# EAGLE design Old_Glove (EAGLE 5.04)
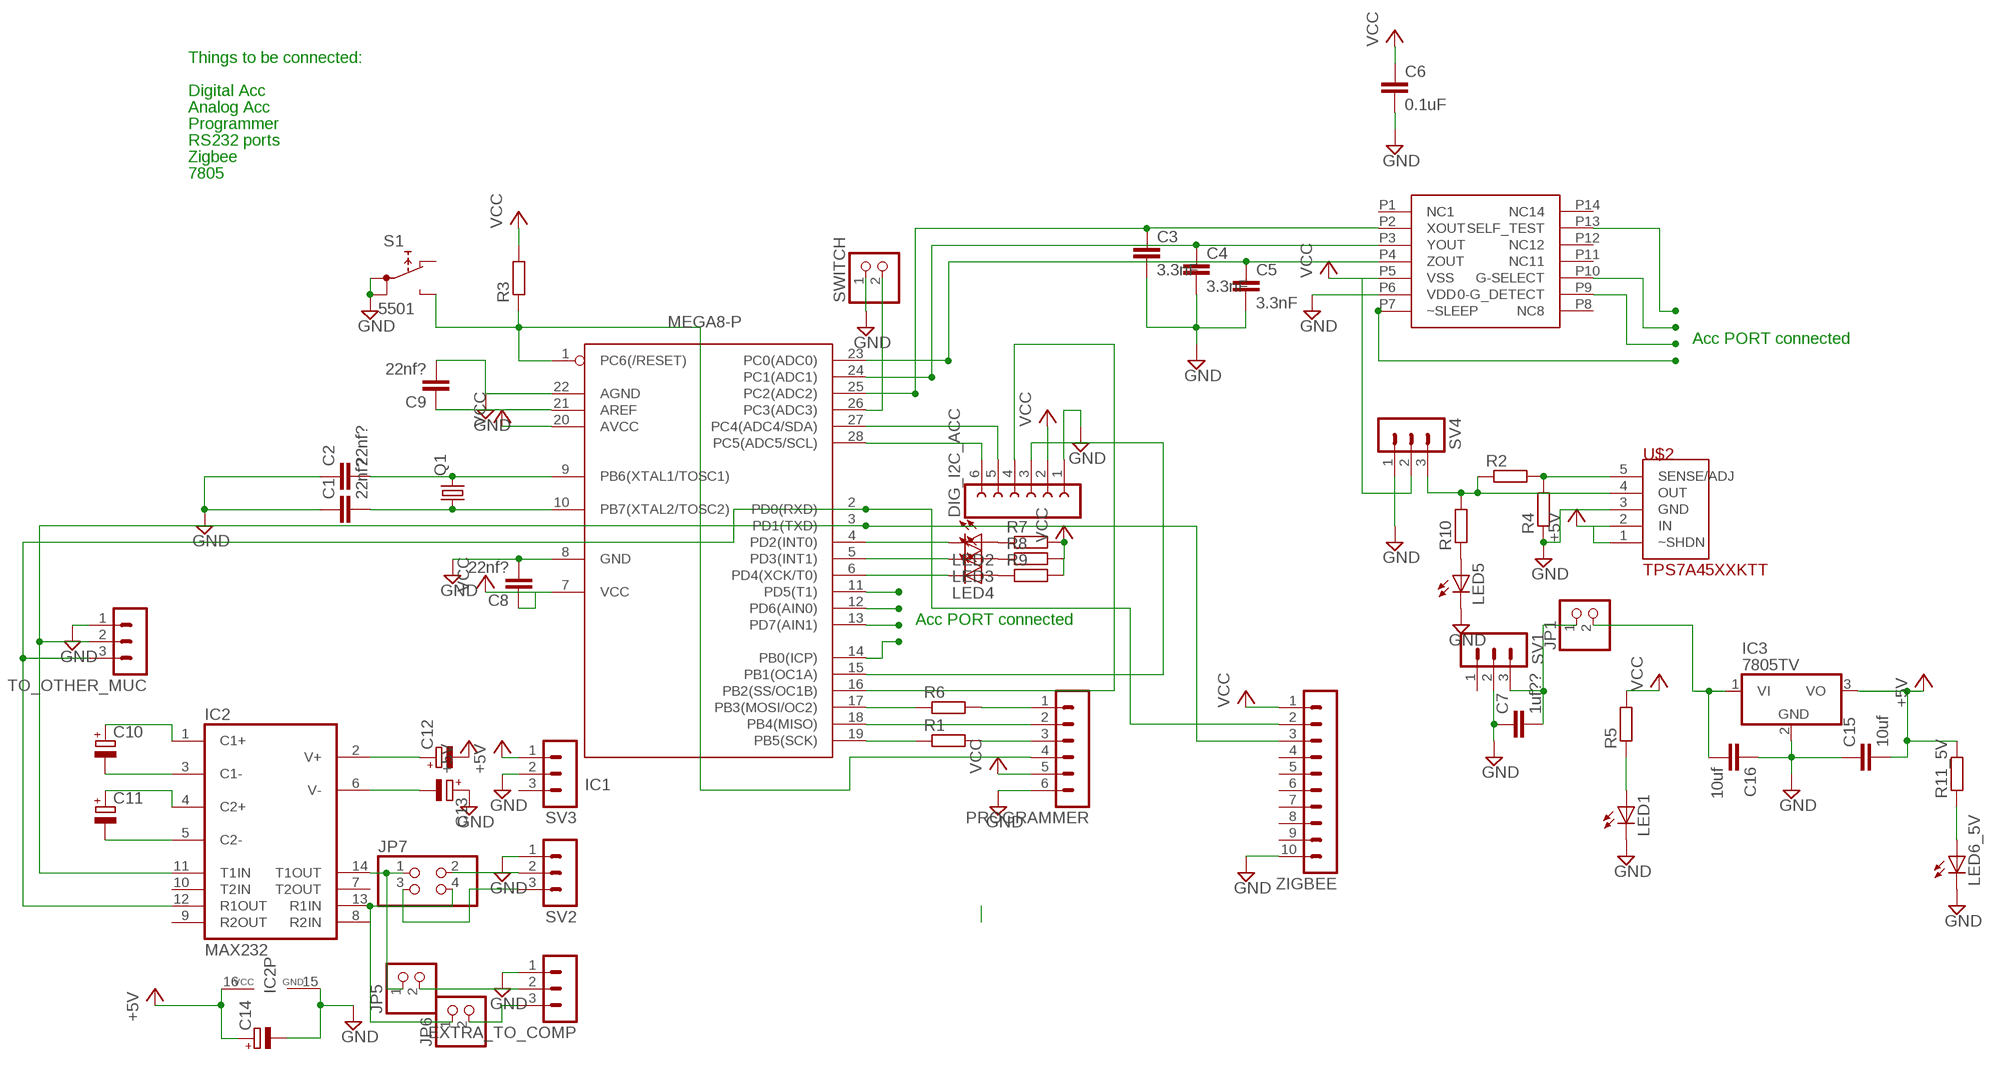
[diagram p0: schematic, sheet 1]

## Parts
C1  22nf?  C-EU025-025X050  [C025-025X050]
C2  22nf?  C-EU025-025X050  [C025-025X050]
C3  3.3nF  C-EUC1206  [C1206]
C4  3.3nF  C-EUC1206  [C1206]
C5  3.3nF  C-EUC1206  [C1206]
C6  0.1uF  C-EUC1206  [C1206]
C7  1uf??  C-EU025-025X050  [C025-025X050]
C8  22nf?  C-EU025-025X050  [C025-025X050]
C9  22nf?  C-EU025-025X050  [C025-025X050]
C10  CPOL-EUE1.8-4  [E1,8-4]
C11  CPOL-EUE1.8-4  [E1,8-4]
C12  CPOL-EUE1.8-4  [E1,8-4]
C13  CPOL-EUE1.8-4  [E1,8-4]
C14  CPOL-EUE1.8-4  [E1,8-4]
C15  10uf  C-EU025-025X050  [C025-025X050]
C16  10uf  C-EU025-025X050  [C025-025X050]
DIG_I2C_ACC  FE06-1  [FE06]
EXTRA_TO_COMP  MA03-1  [MA03-1]
IC1  MEGA8-P  [DIL28-3]
IC2  MAX232  [DIL16]
IC3  7805TV  [TO220V]
JP1  PINHD-1X2  [1X02]
JP5  PINHD-1X2  [1X02]
JP6  PINHD-1X2  [1X02]
JP7  PINHD-2X2  [2X02]
LED1  LED3MM  [LED3MM]
LED2  LED3MM  [LED3MM]
LED3  LED3MM  [LED3MM]
LED4  LED3MM  [LED3MM]
LED5  LED3MM  [LED3MM]
LED6_5V  LED3MM  [LED3MM]
PROGRAMMER  MA06-1  [MA06-1]
Q1  CRYSTALHC49S  [HC49/S]
R1  R-EU_0207/7  [0207/7]
R2  R-EU_0207/7  [0207/7]
R3  R-EU_0207/7  [0207/7]
R4  R-EU_0207/7  [0207/7]
R5  R-EU_0207/7  [0207/7]
R6  R-EU_0207/7  [0207/7]
R7  R-EU_0207/7  [0207/7]
R8  R-EU_0207/7  [0207/7]
R9  R-EU_0207/7  [0207/7]
R10  R-EU_0207/7  [0207/7]
R11_5V  R-EU_0207/7  [0207/7]
S1  5501  [5501]
SV1  MA03-1  [MA03-1]
SV2  MA03-1  [MA03-1]
SV3  MA03-1  [MA03-1]
SV4  MA03-1  [MA03-1]
SWITCH  PINHD-1X2  [1X02]
TO_OTHER_MUC  MA03-1  [MA03-1]
U$1  MMA7361LCMMA7361EXT  [LGA-14EXT]
U$2  TPS7A45XXKTT  [TO263-5]
ZIGBEE  MA10-1  [MA10-1]

## Nets
+5V: C12.- C14.+ C15.2 IC2.16(VCC) IC3.3(VO) R11_5V.2 SV3.1 U$2.1(~SHDN) U$2.2(IN)
AC1: IC1.11(PD5(T1)) U$1.P7(~SLEEP)
AC2: IC1.12(PD6(AIN0)) U$1.P9(0-G_DETECT)
AC3: IC1.13(PD7(AIN1)) U$1.P10(G-SELECT)
AC4: IC1.14(PB0(ICP)) U$1.P13(SELF_TEST)
GND: C1.1 C2.1 C3.2 C4.2 C5.2 C6.2 C7.1 C8.2 C9.2 C13.+ C14.- C15.1 C16.1 DIG_I2C_ACC.1 EXTRA_TO_COMP.1 IC1.8(GND) IC1.22(AGND) IC2.15(GND) IC3.2(GND) LED1.K(C) LED5.K(C) LED6_5V.K(C) PROGRAMMER.6 R4.1 S1.1A S1.1B SV1.2 SV2.1 SV3.2 SV4.1 SWITCH.1 TO_OTHER_MUC.1 U$1.P6(VDD) U$2.3(GND) ZIGBEE.10
N$1: IC1.17(PB3(MOSI/OC2)) R6.1
N$2: PROGRAMMER.1 R6.2
N$3: IC1.18(PB4(MISO)) PROGRAMMER.2
N$4: IC1.19(PB5(SCK)) R1.1
N$5: PROGRAMMER.3 R1.2
N$6: IC1.1(PC6(/RESET)) PROGRAMMER.4 R3.1 S1.NO
N$7: C1.2 IC1.10(PB7(XTAL2/TOSC2)) Q1.1
N$8: C2.2 IC1.9(PB6(XTAL1/TOSC1)) Q1.2
N$9: DIG_I2C_ACC.6 IC1.28(PC5(ADC5/SCL))
N$10: DIG_I2C_ACC.5 IC1.27(PC4(ADC4/SDA))
N$11: DIG_I2C_ACC.3 IC1.15(PB1(OC1A))
N$12: DIG_I2C_ACC.4 IC1.16(PB2(SS/OC1B))
N$13: C5.1 IC1.23(PC0(ADC0)) U$1.P4(ZOUT)
N$14: C4.1 IC1.24(PC1(ADC1)) U$1.P3(YOUT)
N$15: C3.1 IC1.25(PC2(ADC2)) U$1.P2(XOUT)
N$16: LED6_5V.A R11_5V.1
N$17: IC1.3(PD1(TXD)) IC2.11(T1IN) TO_OTHER_MUC.2 ZIGBEE.3
N$18: IC1.2(PD0(RXD)) IC2.12(R1OUT) TO_OTHER_MUC.3 ZIGBEE.2
N$19: R2.2 R4.2 U$2.5(SENSE/ADJ)
N$20: R2.1 R10.2 SV4.3 U$2.4(OUT)
N$21: C9.1 IC1.21(AREF)
N$22: IC1.4(PD2(INT0)) LED2.K(C)
N$23: IC1.5(PD3(INT1)) LED3.K(C)
N$24: IC1.6(PD4(XCK/T0)) LED4.K(C)
N$25: LED1.A R5.1
N$26: LED2.A R7.1
N$27: LED3.A R8.1
N$28: LED4.A R9.1
N$29: LED5.A R10.1
N$30: IC1.26(PC3(ADC3)) SWITCH.2
N$33: C16.2 IC3.1(VI) JP1.2
N$34: JP7.2 SV2.2
N$35: C10.+ IC2.1(C1+)
N$36: C10.- IC2.3(C1-)
N$37: C11.+ IC2.4(C2+)
N$38: C11.- IC2.5(C2-)
N$39: C12.+ IC2.2(V+)
N$40: C13.- IC2.6(V-)
N$41: IC2.14(T1OUT) JP5.1 JP7.1
N$42: IC2.13(R1IN) JP6.1 JP7.4
N$43: C7.2 JP1.1 SV1.3
N$44: JP7.3 SV2.3
N$45: EXTRA_TO_COMP.2 JP5.2
N$47: EXTRA_TO_COMP.3 JP6.2
VCC: C6.1 C8.1 DIG_I2C_ACC.2 IC1.7(VCC) IC1.20(AVCC) PROGRAMMER.5 R3.2 R5.2 R7.2 R8.2 R9.2 SV4.2 U$1.P5(VSS) ZIGBEE.1
Unconnected: IC2.7(T2OUT) IC2.8(R2IN) IC2.9(R2OUT) IC2.10(T2IN) S1.NC SV1.1 SV3.3 U$1.P1(NC1) U$1.P8(NC8) U$1.P11(NC11) U$1.P12(NC12) U$1.P14(NC14) ZIGBEE.4 ZIGBEE.5 ZIGBEE.6 ZIGBEE.7 ZIGBEE.8 ZIGBEE.9

## Notes on the sheet
- Things to be connected:
- Digital Acc
- Analog Acc
- Programmer
- RS232 ports
- Zigbee
- 7805
- Acc PORT connected
- Acc PORT connected

## Library data of the parts
C1-C9 C15 C16 = rcl:C-EU: CAPACITOR, European symbol
C10-C14 = rcl:CPOL-EU: POLARIZED CAPACITOR, European symbol
DIG_I2C_ACC = con-lsta:FE06-1: FEMALE HEADER
EXTRA_TO_COMP SV1-SV4 TO_OTHER_MUC = con-lstb:MA03-1: PIN HEADER
IC1 = atmel:MEGA8-P: MICROCONTROLLER 8 Kbytes FLASH, 1 kbytes SRAM, 512 bytes EEPROM, USART, 4-channel 10 bit ADC, 2-channel 8 bit ADC Pin compatible with Atmega48, ATMega88, ATMega168 Source: avr.lbr
IC2 = maxim:MAX232: RS232 TRANSEIVER
IC3 = linear:78*: Positive VOLTAGE REGULATOR Source: http://cache.national.com/ds/LM/LM78L05.pdf http://www.fairchildsemi.com/ds/LM/LM7805.pdf
JP1 JP5 JP6 SWITCH = pinhead:PINHD-1X2: PIN HEADER
JP7 = pinhead:PINHD-2X2: PIN HEADER
LED1-LED5 LED6_5V = led:LED: LED OSRAM: - CHIPLED LG R971, LG N971, LY N971, LG Q971, LY Q971, LO R971, LY R971 LH N974, LH R974 LS Q976, LO Q976, LY Q976 LO Q996 - Hyper CHIPLED LW Q18S LB Q993, LB Q99A, LB R99A - SideLED LS A670, LO A670, LY A670, LG A670, LP A670 LB A673, LV A673, LT A673, LW A673 LH A674 LY A675 LS A676, LA A676, LO A676, LY A676, LW A676 LS A679, LY A679, LG A679 - Hyper Micro SIDELED® LS Y876, LA Y876, LO Y876, LY Y876 LT Y87S - SmartLED LW L88C, LW L88S LB L89C, LB L89S, LG L890 LS L89K, LO L89K, LY L89K LS L896, LA L896, LO L896, LY L896 - TOPLED LS T670, LO T670, LY T670, LG T670, LP T670 LSG T670, LSP T670, LSY T670, LOP T670, LYG T670 LG T671, LOG T671, LSG T671 LB T673, LV T673, LT T673, LW T673 LH T674 LS T676, LA T676, LO T676, LY T676, LB T676, LH T676, LSB T676, LW T676 LB T67C, LV T67C, LT T67C, LS T67K, LO T67K, LY T67K, LW E67C LS E67B, LA E67B, LO E67B, LY E67B, LB E67C, LV E67C, LT E67C LW T67C LS T679, LY T679, LG T679 LS T770, LO T770, LY T770, LG T770, LP T770 LB T773, LV T773, LT T773, LW T773 LH T774 LS E675, LA E675, LY E675, LS T675 LS T776, LA T776, LO T776, LY T776, LB T776 LHGB T686 LT T68C, LB T68C - Hyper Mini TOPLED® LB M676 - Mini TOPLED Santana® LG M470 LS M47K, LO M47K, LY M47K Source: http://www.osram.convergy.de - LUMILED® LXK2-PW12-R00, LXK2-PW12-S00, LXK2-PW14-U00, LXK2-PW14-V00 LXK2-PM12-R00, LXK2-PM12-S00, LXK2-PM14-U00 LXK2-PE12-Q00, LXK2-PE12-R00, LXK2-PE12-S00, LXK2-PE14-T00, LXK2-PE14-U00 LXK2-PB12-K00, LXK2-PB12-L00, LXK2-PB12-M00, LXK2-PB14-N00, LXK2-PB14-P00, LXK2-PB14-Q00 LXK2-PR12-L00, LXK2-PR12-M00, LXK2-PR14-Q00, LXK2-PR14-R00 LXK2-PD12-Q00, LXK2-PD12-R00, LXK2-PD12-S00 LXK2-PH12-R00, LXK2-PH12-S00 LXK2-PL12-P00, LXK2-PL12-Q00, LXK2-PL12-R00 Source: www.luxeon.com
PROGRAMMER = con-lstb:MA06-1: PIN HEADER
Q1 = crystal:CRYSTAL: CRYSTAL
R1-R10 R11_5V = resistor:R-EU_: RESISTOR, European symbol
S1 = switch:55?: PUSHBUTTON SERIES 5500 SWITCHES Source: www.e-switch.com .. 5500.pdf
U$1 = MMA:MMA7361LC
U$2 = m:TPS7A45XX
ZIGBEE = con-lstb:MA10-1: PIN HEADER

## Board
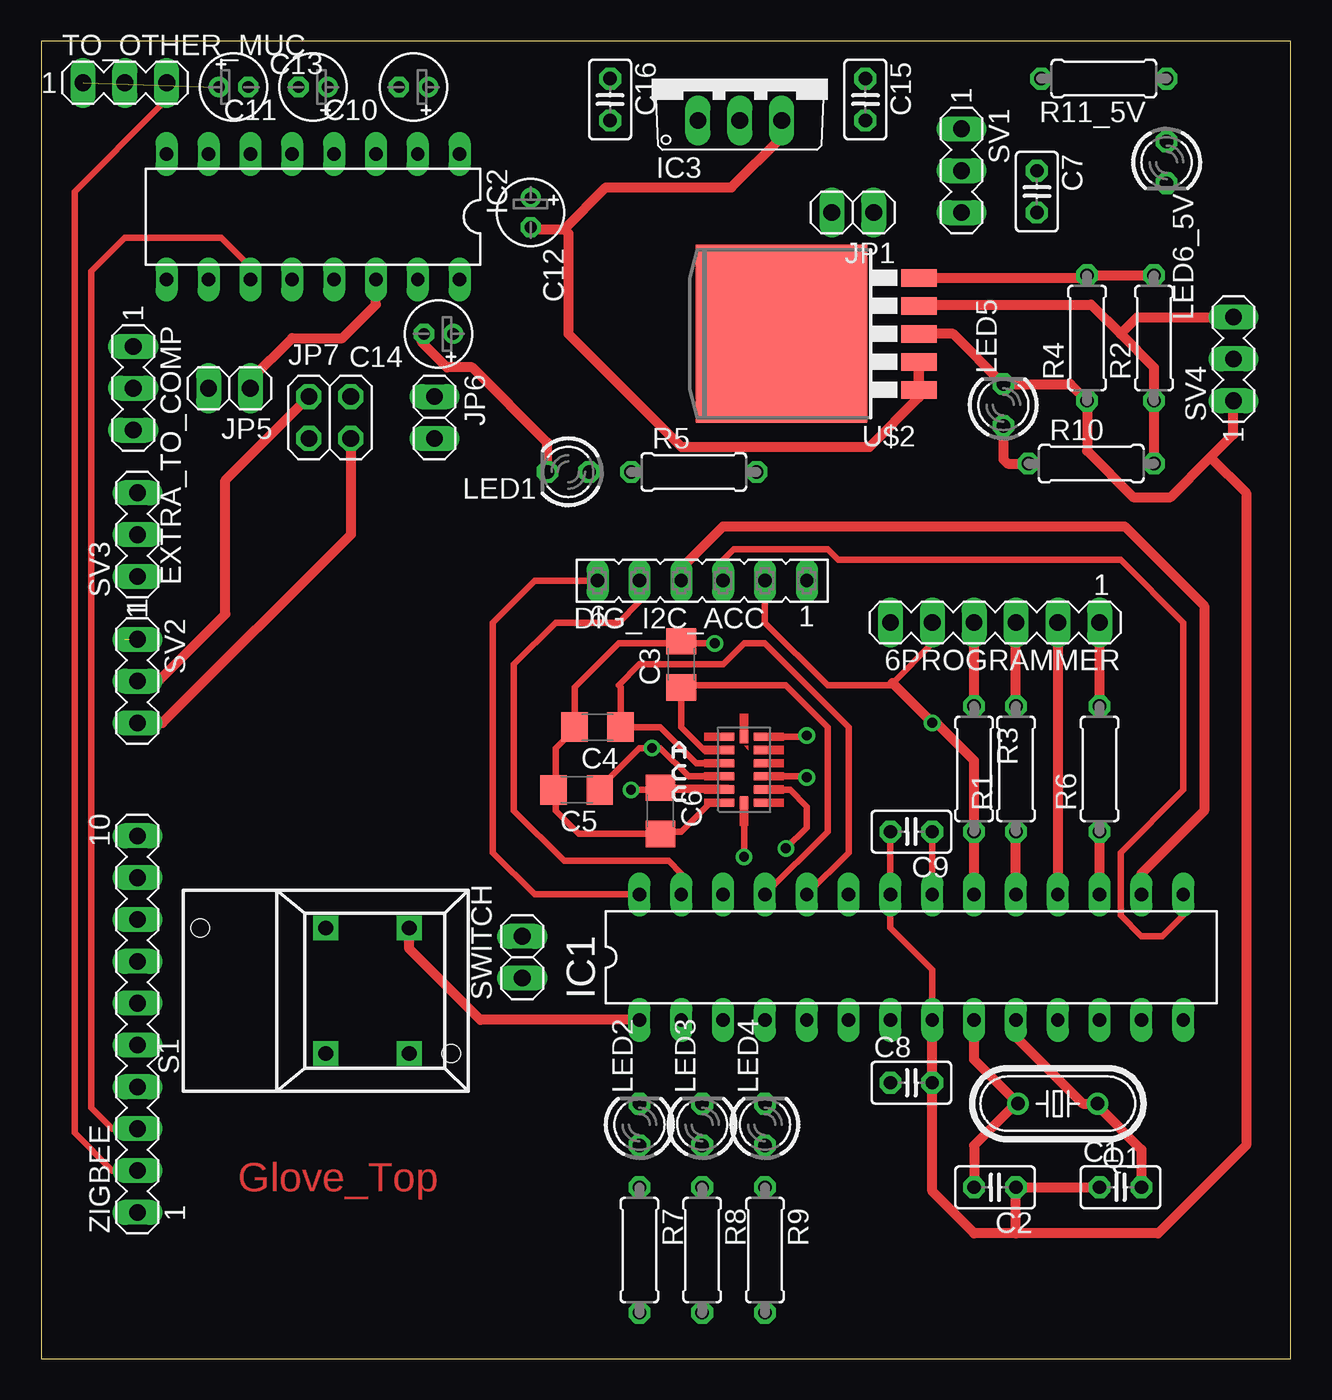
[diagram p1: board, top side]
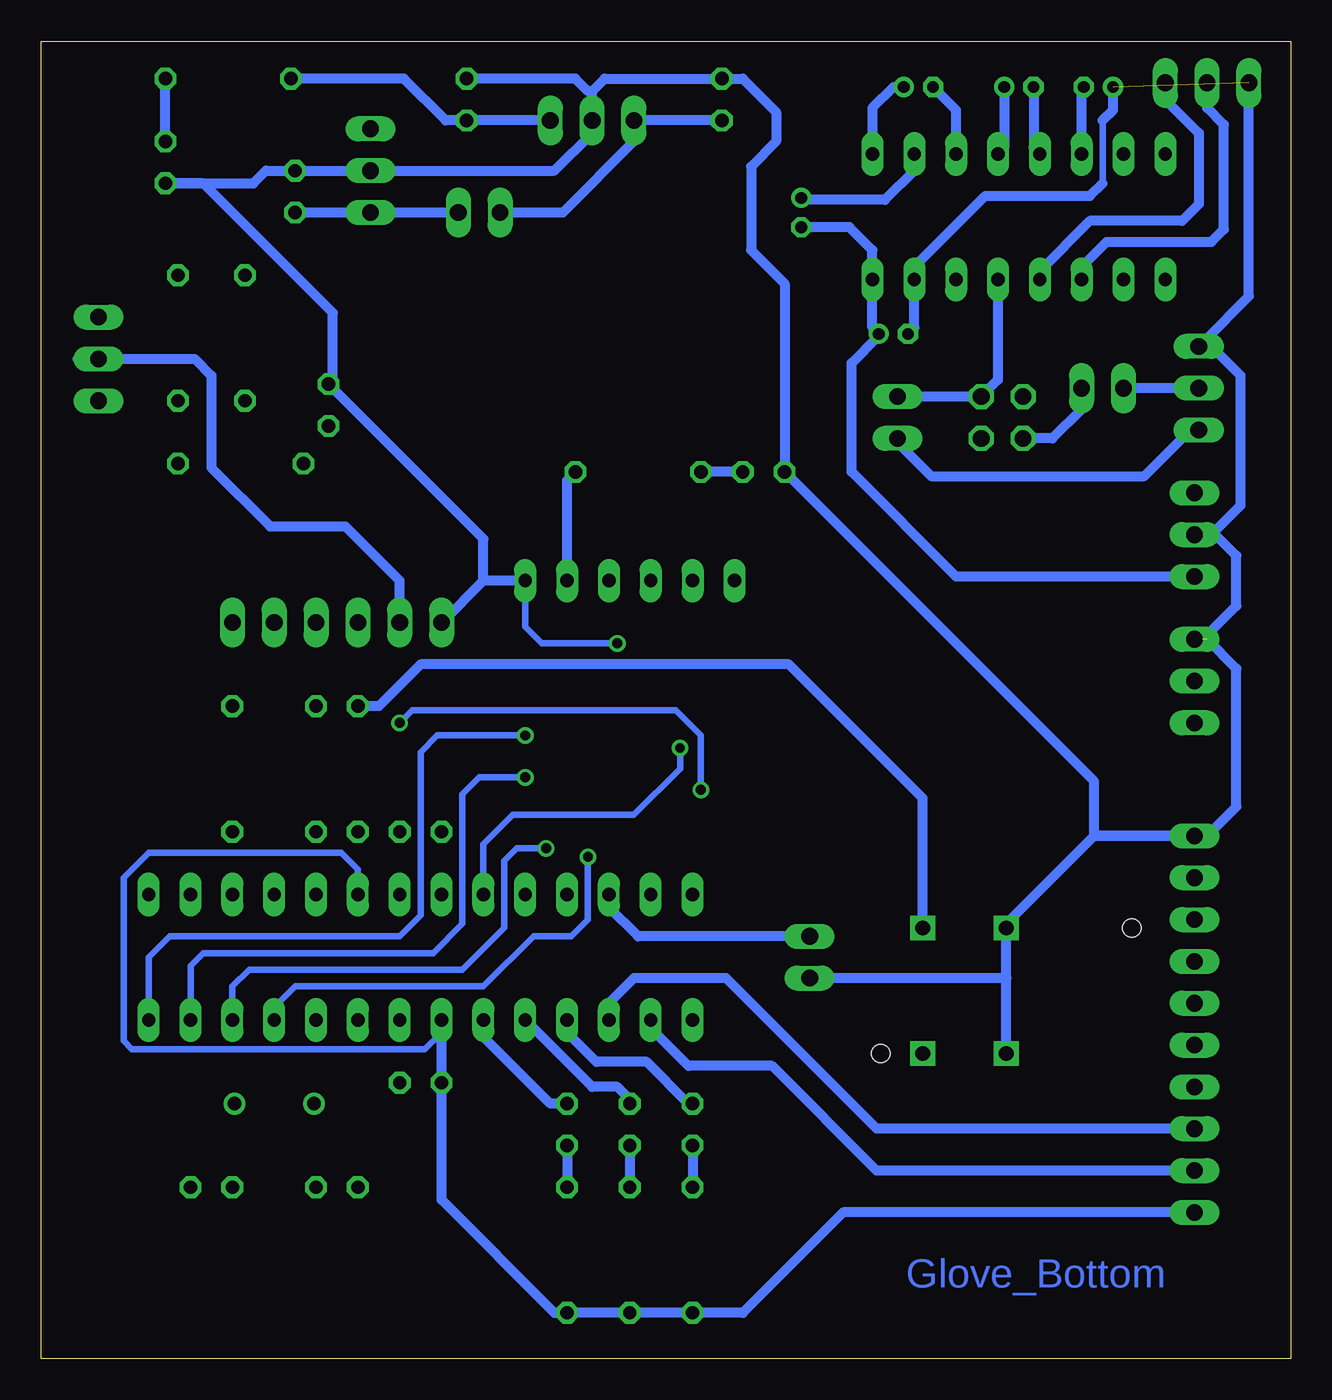
[diagram p2: board, bottom side, seen from below]

Size 75.87 x 80 mm. Coordinates in mm from the lower left corner, seen from the top.
Outline: 0,0 75.87,0 75.87,80 0,80 0,0
Copper layers (1*16): Top 0.035mm / dielectric 1.5mm / Bottom 0.035mm
Design rules "default": minimum track width 10mil, minimum drill 24mil, track to track 8mil, track to pad 8mil, pad to pad 8mil, via to via 8mil, smd to smd 8mil, copper to edge 40mil, drill to drill 8mil, minimum pad ring 10mil, minimum via ring 8mil, stop-mask expansion 4mil, vias tented up to drill 0mil, thermal gap 10mil

### Footprints (pad centres in the part's own frame; a part is rotated, then mirrored left to right if it is on the bottom)
C025-025X050 = drill 0.813 octagon: 1 -1.27,0; 2 1.27,0
C1206 = smd 1.6 x 1.8: 1 -1.4,0; 2 1.4,0
E1,8-4 = drill 0.711 pad 1.168 round: + -0.889,0 | drill 0.711 pad 1.168 octagon: - 0.889,0
FE06 = drill 0.813 long: 1 -6.35,0; 2 -3.81,0; 3 -1.27,0; 4 1.27,0; 5 3.81,0; 6 6.35,0
MA03-1 = drill 1.016 long: 1 -2.54,0; 2 0,0; 3 2.54,0
DIL28-3 = drill 0.813 long: 1 -16.51,-3.81; 2 -13.97,-3.81; 3 -11.43,-3.81; 4 -8.89,-3.81; 5 -6.35,-3.81; 6 -3.81,-3.81; 7 -1.27,-3.81; 8 1.27,-3.81; 9 3.81,-3.81; 10 6.35,-3.81; 11 8.89,-3.81; 12 11.43,-3.81; 13 13.97,-3.81; 14 16.51,-3.81; 15 16.51,3.81; 16 13.97,3.81; 17 11.43,3.81; 18 8.89,3.81; 19 6.35,3.81; 20 3.81,3.81; 21 1.27,3.81; 22 -1.27,3.81; 23 -3.81,3.81; 24 -6.35,3.81; 25 -8.89,3.81; 26 -11.43,3.81; 27 -13.97,3.81; 28 -16.51,3.81
DIL16 = drill 0.813 long: 1 -8.89,-3.81; 2 -6.35,-3.81; 3 -3.81,-3.81; 4 -1.27,-3.81; 5 1.27,-3.81; 6 3.81,-3.81; 7 6.35,-3.81; 8 8.89,-3.81; 9 8.89,3.81; 10 6.35,3.81; 11 3.81,3.81; 12 1.27,3.81; 13 -1.27,3.81; 14 -3.81,3.81; 15 -6.35,3.81; 16 -8.89,3.81
TO220V = drill 1.016 long: 1 -2.54,-2.54; 2 0,-2.54; 3 2.54,-2.54
1X02 = drill 1.016 long: 1 -1.27,0; 2 1.27,0
2X02 = drill 1.016 octagon: 1 -1.27,-1.27; 2 -1.27,1.27; 3 1.27,-1.27; 4 1.27,1.27
LED3MM = drill 0.813 octagon: A -1.27,0; K 1.27,0
MA06-1 = drill 1.016 long: 1 -6.35,0; 2 -3.81,0; 3 -1.27,0; 4 1.27,0; 5 3.81,0; 6 6.35,0
HC49/S = drill 0.813 round: 1 -2.413,0; 2 2.413,0
0207/7 = drill 0.813 octagon: 1 -3.81,0; 2 3.81,0
5501 = drill 0.9 pad 1.5 square: 1A 0,3.81; 1B 0,-3.81; NC 5.08,-3.81; NO 5.08,3.81 | hole 1.1: -7.62,3.81; 7.62,-3.81
LGA-14EXT = smd 0.8 x 0.5: P1 -1,1.95; P2 -1,1.15; P3 -1,0.35; P4 -1,-0.45; P5 -1,-1.25; P6 -1,-2.05; P8 1,-2.05; P9 1,-1.25; P10 1,-0.45; P11 1,0.35; P12 1,1.15; P13 1,1.95 | smd 0.5 x 0.8: P7 0,-2.05; P14 0,1.95
TO263-5 = smd 1.067 x 2.159: 1 -3.404,-5.791; 2 -1.702,-5.791; 3 0,-5.791; 4 1.702,-5.791; 5 3.404,-5.791 | smd 10.8 x 10.41: 6 0,2.54
MA10-1 = drill 1.016 long: 1 -11.43,0; 2 -8.89,0; 3 -6.35,0; 4 -3.81,0; 5 -1.27,0; 6 1.27,0; 7 3.81,0; 8 6.35,0; 9 8.89,0; 10 11.43,0

### Placement (x,y rotation side)
C1  65.53,10.41 0 top
C2  57.91,10.41 180 top
C3  38.86,42.16 90 top
C4  33.78,38.35 180 top
C5  32.51,34.54 180 top
C6  37.59,33.27 270 top
C7  60.45,70.87 270 top
C8  52.83,16.76 0 top
C9  52.83,32 180 top
C10  22.61,77.22 180 top
C11  16.51,77.22 180 top
C12  29.72,69.6 270 top
C13  11.68,77.22 0 top
C14  24.13,62.23 180 top
C15  50.04,76.45 270 top
C16  34.54,76.45 270 top
DIG_I2C_ACC  40.13,47.24 180 top
EXTRA_TO_COMP  5.59,58.93 270 top
IC1  52.83,24.38 0 top
IC2  16.51,69.34 180 top
IC3  42.42,77.72 0 top
JP1  49.28,69.6 180 top
JP5  11.43,58.93 180 top
JP6  23.88,57.15 270 top
JP7  17.53,57.15 0 top
LED1  32,53.85 180 top
LED2  36.32,14.22 90 top
LED3  40.13,14.22 90 top
LED4  43.94,14.22 90 top
LED5  58.42,57.91 90 top
LED6_5V  68.33,72.64 270 top
PROGRAMMER  57.91,44.7 180 top
Q1  61.72,15.49 180 top
R1  59.18,35.81 90 top
R2  67.56,61.98 90 top
R3  56.64,35.81 270 top
R4  63.5,61.98 90 top
R5  39.62,53.85 0 top
R6  64.26,35.81 90 top
R7  36.32,6.6 270 top
R8  40.13,6.6 270 top
R9  43.94,6.6 270 top
R10  63.75,54.36 0 top
R11_5V  64.52,77.72 180 top
S1  17.27,22.35 0 top
SV1  55.88,72.14 270 top
SV2  5.84,41.15 270 top
SV3  5.84,50.04 90 top
SV4  72.39,60.71 90 top
SWITCH  29.21,24.38 90 top
TO_OTHER_MUC  5.08,77.47 0 top
U$1  42.67,35.81 0 top
U$2  47.5,62.23 90 top
ZIGBEE  5.84,20.32 90 top

### Tracks (layer width: path | path; a pad name or v marks a point on that pad's centre or on a via)
+5V
  Top 0.61: IC3.3 44.96,74.17 41.91,71.12 34.29,71.12 31.75,68.58 | 31.75,68.58 29.84,68.58 C12.- | U$2.1 U$2.2 53.29,58.37 50.29,55.37 38.86,55.37 32,62.23 32,68.33 31.75,68.58
  Bottom 0.61: C12.- 26.8,68.71 25.4,67.31 IC2.16 25.4,62.61 C14.+ 25.02,62.1 26.67,60.45 26.67,53.85 20.32,47.5 SV3.1 | IC3.3 C15.2 51.31,75.18 53.85,77.72 R11_5V.2
AC1  (via drill 0.6)
  Top 0.406: v42.67,30.48 U$1.P7
  Bottom 0.406: IC1.11 61.72,21.34 60.45,22.61 49.02,22.61 45.97,25.65 43.69,25.65 42.67,26.67 v42.67,30.48
AC2  (via drill 0.6)
  Top 0.406: U$1.P9 43.69,34.54 45.47,34.54 46.48,33.53 46.48,32.26 v45.21,30.99
  Bottom 0.406: IC1.12 64.26,22.61 63.25,23.62 50.29,23.62 47.75,26.16 47.75,30.23 46.99,30.99 v45.21,30.99
AC3  (via drill 0.6)
  Top 0.406: v46.48,35.31 46.42,35.36 U$1.P10
  Bottom 0.406: IC1.13 66.8,23.88 66.04,24.64 52.07,24.64 50.29,26.42 50.29,34.29 49.28,35.31 v46.48,35.31
AC4  (via drill 0.6)
  Top 0.406: U$1.P13 46.4,37.76 v46.48,37.85
  Bottom 0.406: IC1.14 69.34,24.38 68.07,25.65 54.1,25.65 52.83,26.92 52.83,36.83 51.82,37.85 47.75,37.85 | v46.48,37.85 47.75,37.85 | 47.75,37.85 48.26,37.85
GND  (via drill 0.6)  (2 unrouted)
  Top 0.406: U$1.P6 40.62,33.76 38.86,32 37.72,32 C6.2 32.64,31.87 31.24,33.27 31.24,34.41 C5.2 31.24,34.67 31.24,37.08 32.38,38.22 C4.2 32.38,40.76 35.05,43.43 38.73,43.43 C3.2 38.99,43.43 v40.89,43.43 | C9.2 IC1.22 51.56,26.16 53.72,24 | IC1.8 54.1,23.62 53.72,24 | 53.72,24 53.59,24.13
  Top 0.61: U$2.3 55.37,62.23 LED5.K 62.48,59.18 R4.1 63.5,55.12 66.29,52.32 68.58,52.32 70.99,54.74 | SV4.1 72.39,56.13 70.99,54.74 | C1.1 C2.1 59.18,7.62 | IC1.8 C8.2 54.1,10.16 56.64,7.62 59.18,7.62 | 59.18,7.62 67.82,7.62 73.15,12.95 73.15,52.58 70.99,54.74 | LED1.K 30.73,55.63 26.16,60.2 24.64,60.2 23.11,61.72 23.11,62.1 C14.-
  Bottom 0.406: v40.89,43.43 45.47,43.43 46.48,44.45 DIG_I2C_ACC.1 | 11.43,71.37 11.43,75.18
  Bottom 0.61: 42.42,76.96 41.66,77.72 C16.1 33.27,77.72 31.24,75.69 31.24,73.91 32.77,72.39 32.77,67.31 30.73,65.28 LED1.K 11.94,35.05 11.94,31.75 | 42.42,76.96 IC3.2 42.42,74.42 44.7,72.14 SV1.2 | 42.42,76.96 42.67,76.96 43.43,77.72 C15.1 | SV1.2 C7.1 62.23,72.14 | TO_OTHER_MUC.1 2.54,64.52 5.21,61.85 | 5.21,61.85 EXTRA_TO_COMP.1 | 5.33,43.69 3.3,45.72 3.3,48.77 4.57,50.04 SV3.2 4.83,50.04 3.05,51.82 3.05,59.69 5.21,61.85 | SV2.1 5.08,43.69 3.3,41.91 3.3,33.53 5.08,31.75 5.59,31.75 | 5.59,31.75 ZIGBEE.10 11.94,31.75 | C13.+ 10.79,75.82 11.43,75.18 | 11.43,71.37 12.19,70.61 18.54,70.61 22.86,66.29 IC2.15 22.86,62.61 C14.- | DIG_I2C_ACC.1 49.02,47.24 | 49.02,47.24 PROGRAMMER.6 | 49.02,47.24 49.02,49.78 LED5.K 58.17,59.44 58.17,63.5 66.04,71.37 LED6_5V.K 62.99,71.37 62.23,72.14 | 62.23,72.14 SV1.2 | S1.1B 17.27,23.11 | 17.27,23.11 S1.1A | 17.27,23.11 SWITCH.1 | 17.27,23.11 17.27,26.42 11.94,31.75 | 5.59,31.75 11.94,31.75
N$1
  Top 0.61: IC1.17 R6.1
N$2
  Top 0.61: R6.2 PROGRAMMER.1
N$3
  Top 0.61: PROGRAMMER.2 IC1.18
N$4
  Top 0.61: IC1.19 R1.1
N$5
  Top 0.61: R1.2 PROGRAMMER.3
N$6
  Top 0.61: R3.1 PROGRAMMER.4 | IC1.1 26.67,20.57 22.35,24.89 S1.NO
  Bottom 0.61: R3.1 55.37,39.62 52.83,42.16 30.48,42.16 22.35,34.04 S1.NO
N$7
  Top 0.61: IC1.10 59.18,19.56 63.25,15.49 Q1.1 64.14,15.37 66.8,12.7 C1.2
N$8
  Top 0.61: IC1.9 56.64,18.16 Q1.2 59.18,15.49 56.64,12.95 C2.2
N$9
  Top 0.406: DIG_I2C_ACC.6 29.97,47.24 27.43,44.7 27.43,30.73 29.97,28.19 IC1.28
N$10
  Top 0.406: IC1.27 38.86,29.46 38.1,30.23 31.75,30.23 28.7,33.27 28.7,42.16 31.24,44.7 35.05,44.7 36.32,45.97 DIG_I2C_ACC.5
N$11
  Top 0.406: IC1.15 69.34,26.92 68.07,25.65 66.8,25.65 65.53,26.92 65.53,30.73 69.34,34.54 69.34,44.7 65.53,48.51 48.39,48.51 47.75,49.15 42.04,49.15 41.4,48.51 DIG_I2C_ACC.3
N$12
  Top 0.61: DIG_I2C_ACC.4 38.86,48.01 41.4,50.55 65.79,50.55 70.61,45.72 70.61,33.27 66.8,29.46 IC1.16
N$13  (via drill 0.6)
  Top 0.406: C5.1 33.91,34.67 36.32,37.08 v37.08,37.08 37.59,37.08 39.31,35.36 U$1.P4
  Bottom 0.406: IC1.23 49.02,31.24 47.24,33.02 39.88,33.02 37.08,35.81 v37.08,37.08
N$14
  Top 0.406: U$1.P3 39.78,36.16 37.59,38.35 C4.1 35.18,40.76 35.05,40.89 36.32,42.16 41.4,42.16 42.67,43.43 43.94,43.43 49.02,38.35 49.02,30.73 IC1.24
N$15
  Top 0.406: U$1.P2 40.25,36.96 38.86,38.35 C3.1 38.99,40.89 45.21,40.89 47.75,38.35 47.75,32 IC1.25
N$16
  Bottom 0.61: LED6_5V.A R11_5V.1
N$17
  Top 0.406: IC2.11 12.7,66.29 10.92,68.07 5.08,68.07 3.05,66.04 3.05,15.24 4.32,13.97 ZIGBEE.3
  Bottom 0.61: TO_OTHER_MUC.2 5.08,75.95 4.06,74.93 4.06,68.58 4.83,67.82 11.18,67.82 12.7,66.29 IC2.11 | IC1.3 41.4,21.59 39.88,23.11 34.29,23.11 25.15,13.97 ZIGBEE.3
N$18
  Top 0.406: ZIGBEE.2 4.32,11.43 2.03,13.72 2.03,70.87 7.24,76.07 7.24,77.09 TO_OTHER_MUC.3
  Bottom 0.61: IC2.12 15.24,66.04 12.19,69.09 6.6,69.09 5.59,70.1 5.59,74.42 7.62,76.45 TO_OTHER_MUC.3 | IC1.2 38.86,20.07 36.58,17.78 31.5,17.78 25.15,11.43 ZIGBEE.2
N$19
  Top 0.61: U$2.5 63.35,65.63 R4.2 R2.2
N$20
  Top 0.61: R10.2 R2.1 67.56,60.2 65.53,62.23 | 65.53,62.23 63.75,64.01 53.37,64.01 U$2.4 | SV4.3 66.55,63.25 65.53,62.23
N$21
  Top 0.406: IC1.21 C9.1
N$22
  Bottom 0.61: LED2.K 36.58,15.49 39.12,18.03 42.16,18.03 43.94,19.81 IC1.4
N$23
  Bottom 0.61: LED3.K 40.13,15.75 40.89,16.51 42.42,16.51 IC1.5
N$24
  Bottom 0.61: LED4.K 44.96,15.49 49.02,19.56 IC1.6
N$25
  Bottom 0.61: LED1.A R5.1
N$26
  Bottom 0.61: LED2.A R7.1
N$27
  Bottom 0.61: LED3.A R8.1
N$28
  Bottom 0.61: LED4.A R9.1
N$29
  Top 0.61: LED5.A 58.42,54.61 58.67,54.36 R10.1
N$30
  Bottom 0.61: IC1.26 41.4,27.43 39.62,25.65 SWITCH.2
N$31  (via drill 0.6)
  other vias: 45.21,30.99
N$33
  Bottom 0.61: C16.2 IC3.1 39.88,73.91 44.2,69.6 JP1.2
N$34
  Top 0.61: SV2.2 7.11,41.15 11.18,45.21 11.18,53.34 JP7.2
N$35
  Bottom 0.61: C10.+ 24.13,77.22 25.4,75.95 IC2.1
N$36
  Bottom 0.61: IC2.3 20.32,75.82 C10.-
N$37
  Bottom 0.61: C11.+ 17.4,73.53 IC2.4
N$38
  Bottom 0.61: C11.- 15.62,73.53 IC2.5
N$39
  Bottom 0.61: IC2.2 22.86,72.14 24.64,70.36 29.59,70.36 C12.+
N$40
  Bottom 0.61: IC2.6 12.7,77.09 C13.-
N$41
  Top 0.61: JP5.1 12.7,59.44 15.24,61.98 18.29,61.98 20.32,64.01 IC2.14
  Bottom 0.61: JP5.1 12.7,57.66 14.48,55.88 JP7.1
N$42
  Bottom 0.61: JP6.1 JP7.4 17.78,59.44 IC2.13
N$43
  Bottom 0.61: C7.2 SV1.3 JP1.1
N$44
  Top 0.61: JP7.3 18.8,50.04 7.37,38.61 SV2.3
N$45
  Bottom 0.61: EXTRA_TO_COMP.2 JP5.2
N$47
  Bottom 0.61: JP6.2 23.88,55.63 21.84,53.59 8.89,53.59 6.1,56.39 EXTRA_TO_COMP.3
VCC  (via drill 0.6)
  Top 0.406: 41.67,34.67 C6.1 | 41.67,34.67 U$1.P5 | v54.1,38.61 54.1,38.35 | PROGRAMMER.5 54.1,43.43 51.69,41.02 51.56,40.89 47.75,40.89 43.94,44.7 DIG_I2C_ACC.2 | 41.67,34.67 41.54,34.54 v35.81,34.54
  Top 0.61: IC1.20 R3.2 56.64,36.32 54.36,38.61 v54.1,38.61 51.69,41.02
  Bottom 0.406: IC1.20 56.64,29.72 57.66,30.73 69.34,30.73 70.87,29.21 70.87,19.3 70.36,18.8 52.58,18.8 51.56,19.81 51.56,20.07 IC1.7 | v35.81,34.54 35.81,37.85 37.34,39.37 53.34,39.37 v54.1,38.61
  Bottom 0.61: 73.66,60.71 SV4.2 66.55,60.71 65.53,59.69 65.53,54.1 61.98,50.55 57.4,50.55 54.1,47.24 PROGRAMMER.5 | ZIGBEE.1 27.18,8.89 33.27,2.79 R7.2 R8.2 R9.2 44.7,2.79 51.56,9.65 C8.1 51.56,20.07 | R5.2 43.94,53.34 DIG_I2C_ACC.2

### Text on the board
Top: Glove_Top
Bottom: Glove_Bottom